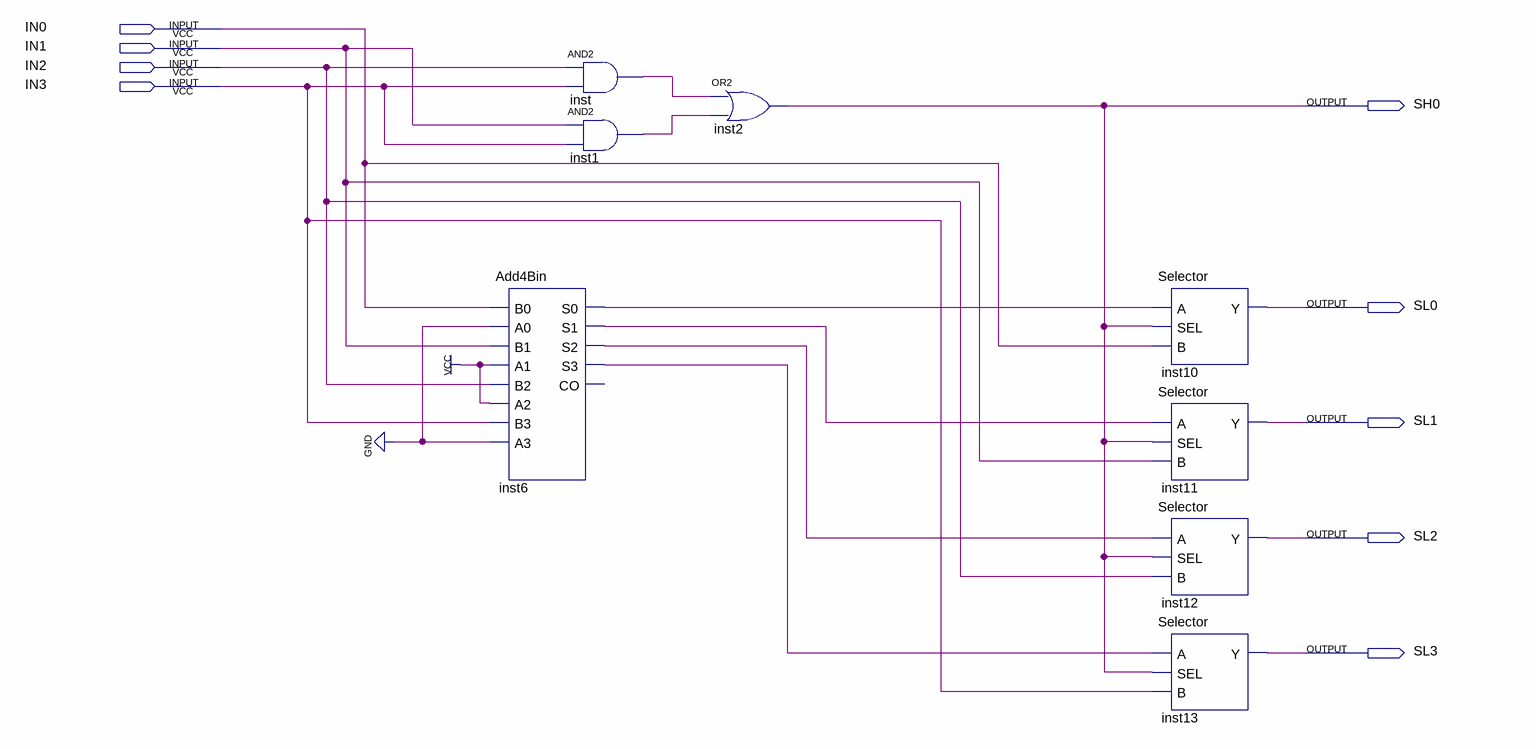
[diagram p0: schematic sheet]
// Quartus schematic BinToDec.bdf as structural Verilog: 8 symbols, 9 pins
module BinToDec (
  input  IN0,
  input  IN1,
  input  IN2,
  input  IN3,
  output SH0,
  output SL0,
  output SL1,
  output SL2,
  output SL3
);

  wire inst1_out, inst6_s0, inst6_s1, inst6_s2, inst6_s3, inst_out;

  Add4Bin inst6 (
    .B0(IN0), .A0(1'b0), .B1(IN1), .A1(1'b1), .B2(IN2), .A2(1'b1), .B3(IN3), .A3(1'b0), .S0(inst6_s0),
    .S1(inst6_s1), .S2(inst6_s2), .S3(inst6_s3));  // open: CO
  and inst (inst_out, IN2, IN3);
  and inst1 (inst1_out, IN1, IN3);
  or inst2 (SH0, inst_out, inst1_out);
  Selector inst10 (.A(inst6_s0), .SEL(SH0), .B(IN0), .Y(SL0));
  Selector inst11 (.A(inst6_s1), .SEL(SH0), .B(IN1), .Y(SL1));
  Selector inst12 (.A(inst6_s2), .SEL(SH0), .B(IN2), .Y(SL2));
  Selector inst13 (.A(inst6_s3), .SEL(SH0), .B(IN3), .Y(SL3));
endmodule
